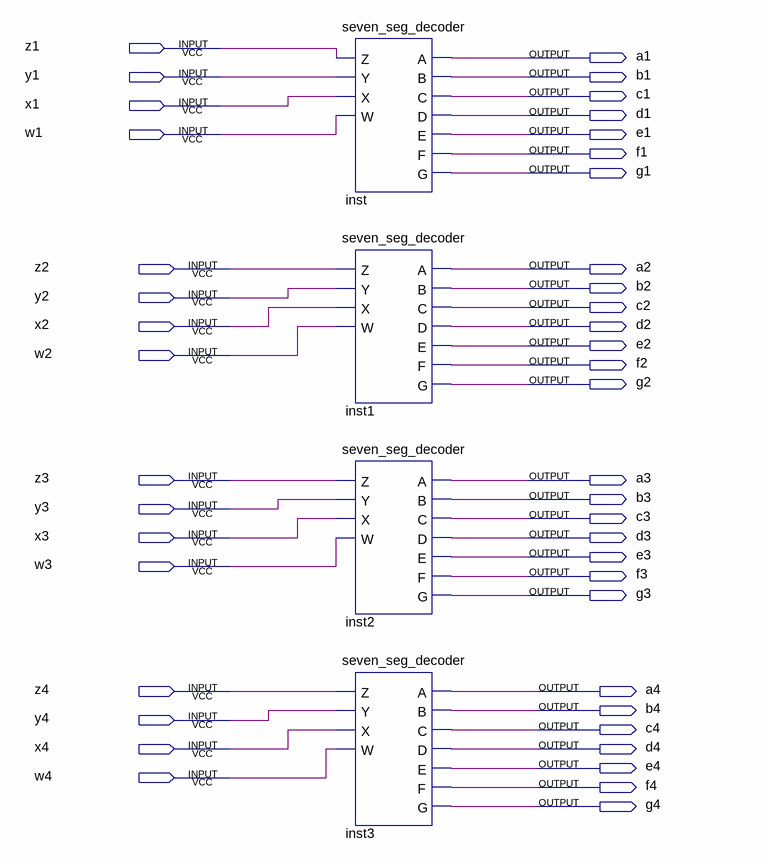
[diagram p0: schematic sheet]
// Quartus schematic lab5step1.bdf as structural Verilog: 4 symbols, 44 pins
module lab5step1 (
  input  z1,
  input  y1,
  input  x1,
  input  w1,
  input  z2,
  input  y2,
  input  x2,
  input  w2,
  input  z3,
  input  y3,
  input  x3,
  input  w3,
  input  z4,
  input  y4,
  input  x4,
  input  w4,
  output a1,
  output b1,
  output c1,
  output d1,
  output e1,
  output f1,
  output g1,
  output a2,
  output b2,
  output c2,
  output d2,
  output e2,
  output f2,
  output g2,
  output a3,
  output b3,
  output c3,
  output d3,
  output e3,
  output f3,
  output g3,
  output a4,
  output b4,
  output c4,
  output d4,
  output e4,
  output f4,
  output g4
);

  seven_seg_decoder inst (.Z(z1), .Y(y1), .X(x1), .W(w1), .A(a1), .B(b1), .C(c1), .D(d1), .E(e1), .F(f1), .G(g1));
  seven_seg_decoder inst1 (.Z(z2), .Y(y2), .X(x2), .W(w2), .A(a2), .B(b2), .C(c2), .D(d2), .E(e2), .F(f2), .G(g2));
  seven_seg_decoder inst2 (.Z(z3), .Y(y3), .X(x3), .W(w3), .A(a3), .B(b3), .C(c3), .D(d3), .E(e3), .F(f3), .G(g3));
  seven_seg_decoder inst3 (.Z(z4), .Y(y4), .X(x4), .W(w4), .A(a4), .B(b4), .C(c4), .D(d4), .E(e4), .F(f4), .G(g4));
endmodule
